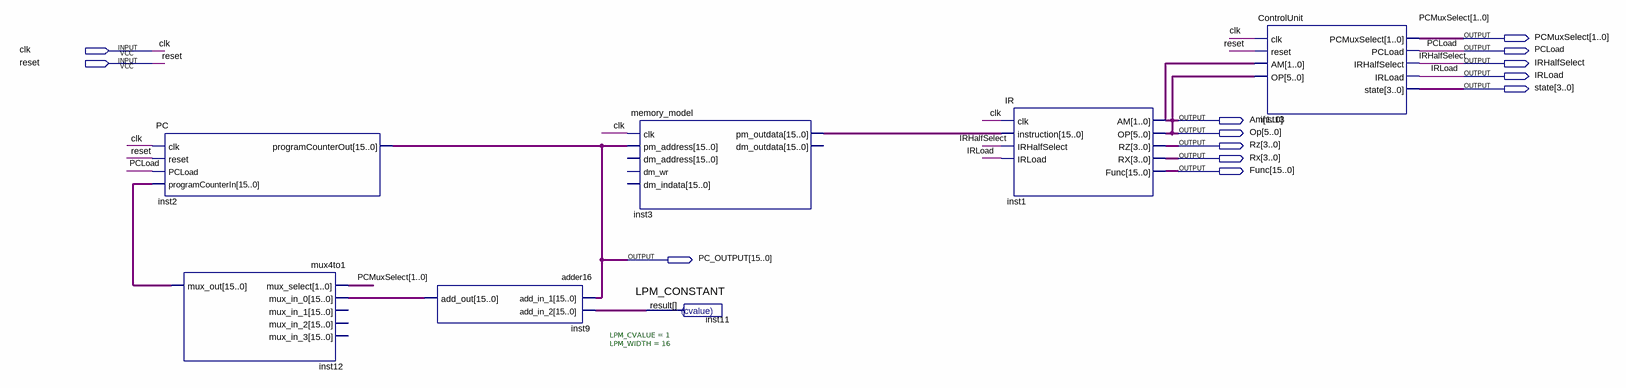
[diagram p0: schematic sheet]
// Quartus schematic MEMORY_CONTROLUNIT_testbench.bdf as structural Verilog: 7 symbols, 13 pins
module MEMORY_CONTROLUNIT_testbench (
  input  clk,
  input  reset,
  output [1:0] PCMuxSelect,
  output PCLoad,
  output IRHalfSelect,
  output IRLoad,
  output [3:0] state,
  output [1:0] Am,
  output [5:0] Op,
  output [3:0] Rz,
  output [3:0] Rx,
  output [15:0] Func,
  output [15:0] PC_OUTPUT
);

  wire [15:0] inst3_pm_outdata, inst9_add_out, inst11_result, inst12_mux_out;

  PC inst2 (
    .clk(clk), .reset(reset), .PCLoad(PCLoad), .programCounterIn(inst12_mux_out),
    .programCounterOut(PC_OUTPUT));
  mux4to1 inst12 (
    .mux_select(PCMuxSelect), .mux_in_0(inst9_add_out), .mux_out(inst12_mux_out));  // open: mux_in_1, mux_in_2, mux_in_3
  adder16 inst9 (.add_in_1(PC_OUTPUT), .add_in_2(inst11_result), .add_out(inst9_add_out));
  memory_model inst3 (
    .clk(clk), .pm_address(PC_OUTPUT), .pm_outdata(inst3_pm_outdata));  // open: dm_address, dm_wr, dm_indata, dm_outdata
  LPM_CONSTANT #(.LPM_CVALUE(1), .LPM_WIDTH(16)) inst11 (.result(inst11_result));
  IR inst1 (
    .clk(clk), .instruction(inst3_pm_outdata), .IRHalfSelect(IRHalfSelect), .IRLoad(IRLoad), .AM(Op),
    .OP(Op), .RZ(Rz), .RX(Rx), .Func(Func));
  ControlUnit inst13 (
    .clk(clk), .reset(reset), .AM(Op), .OP(Op), .PCMuxSelect(PCMuxSelect), .PCLoad(PCLoad),
    .IRHalfSelect(IRHalfSelect), .IRLoad(IRLoad), .state(state));
endmodule
